# Altium schematic sheet Channel Fix (CMOS).SchDoc
size A4
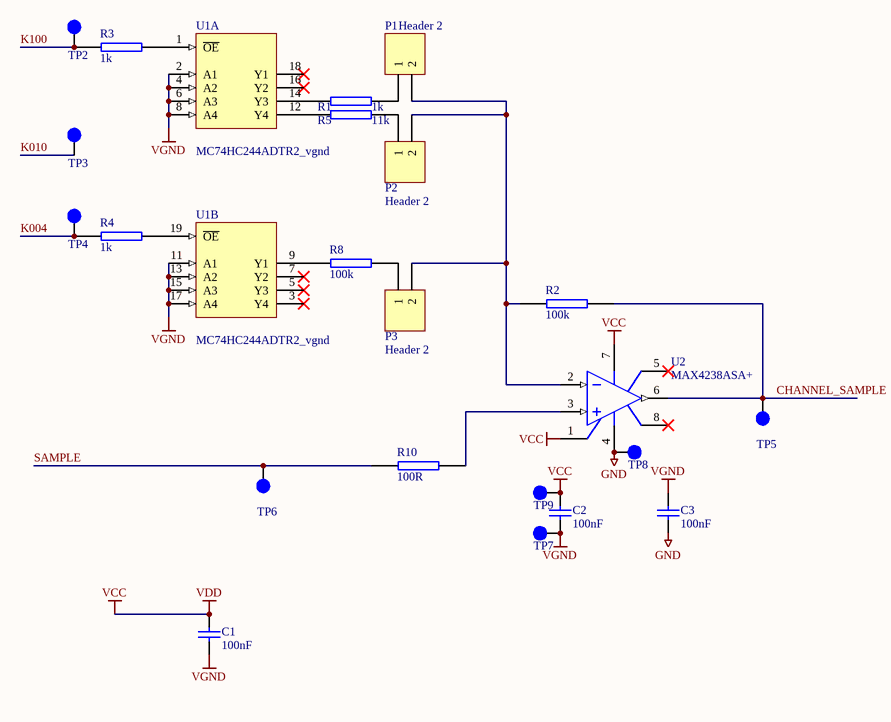
[diagram p0: Channel Fix (CMOS).SchDoc]

## Parts
C1  100nF  [CAP (3D) - 0805]
C2  100nF  [CAP (3D) - 0805]
C3  100nF  [CAP (3D) - 0805]
P1  Header 2  [HDR1X2]
P2  Header 2  [HDR1X2]
P3  Header 2  [HDR1X2]
R1  1k  [RES (3D) - 0805]
R2  100k  [RES (3D) - 0805]
R3  1k  [RES (3D) - 0805]
R4  1k  [RES (3D) - 0805]
R5  11k  [RES (3D) - 0805]
R8  100k  [RES (3D) - 0805]
R10  100R  [RES (3D) - 0805]
TP2  TestPoint  [TP]  (value not drawn)
TP3  TestPoint  [TP]  (value not drawn)
TP4  TestPoint  [TP]  (value not drawn)
TP5  TestPoint  [TP]  (value not drawn)
TP6  TestPoint  [TP]  (value not drawn)
TP7  TestPoint  [TP]  (value not drawn)
TP8  TestPoint  [TP]  (value not drawn)
TP9  TestPoint  [TP]  (value not drawn)
U1  MC74HC244ADTR2_vgnd  [DIP 20]  (parts A,B of 2)
U2  MAX4238ASA+  [SO-8]

## Nets
GND: C3.1 TP8.1 U2.4(VEE)
VCC: C1.2 C2.2 TP9.1 U1.20(VDD) U2.1(NULL) U2.7(VCC)  [also labelled VDD]
VGND: C1.1 C2.1 C3.2 TP7.1 U1.2(A1) U1.4(A2) U1.6(A3) U1.8(A4) U1.10(GND) U1.11(A1) U1.13(A2) U1.15(A3) U1.17(A4)
CHANNEL_SAMPLE: R2.2 TP5.1 U2.6(OUT)
K004: R4.1 TP4.1
K010: TP3.1
K100: R3.1 TP2.1
SAMPLE: R10.1 TP6.1
NetP1_1: P1.1 R1.2
NetP1_2: P1.2 P2.2 P3.2 R2.1 U2.2(IN-)
NetP2_1: P2.1 R5.2
NetP3_1: P3.1 R8.2
NetR1_1: R1.1 U1.14(Y3)
NetR3_2: R3.2 U1.1(~{OE})
NetR4_2: R4.2 U1.19(~{OE})
NetR5_1: R5.1 U1.12(Y4)
NetR8_1: R8.1 U1.9(Y1)
NetR10_2: R10.2 U2.3(IN+)

Not connected (* = marked no-connect by the designer): U1 3(Y4)* 5(Y3)* 7(Y2)* 16(Y2)* 18(Y1)*; U2 5(NULL)* 8(NC)*

## Library data of the parts
C1-C3 = Cap: Capacitor; Value: 100nF; Supplier 1: Mouser; Supplier 2: Digi-Key; Supplier Part Number 1: 603-C0603ZRY5V9BB104; Supplier Part Number 2: 311-1343-2-ND
P1-P3 = Header 2: Header, 2-Pin; LatestRevisionDate: 17-Jul-2002; LatestRevisionNote: Re-released for DXP Platform.; Publisher: Altium Limited
R1-R5 R8 R10 = RES SMD 0603: RESISTOR SMD 0603
  R1 R3 R4: value: 1k
  R2 R8: value: 100k
  R5: value: 11k
  R10: value: 100R
U1 = MC74HC244ADTR2: Octal 3-State Non-Inverting Buffer/Line Driver/Line Receiver; Published: 15-Apr-2002; LatestRevisionDate: 12-Dec-2006; LatestRevisionNote: IPC-7351 Footprint Added.; DatasheetVersion: Mar-2000; PackageVersion: Mar-2000; PackageReference: 948E-02; Publisher: Altium Limited; PackageDescription: 20-Pin Thin Small Outline Package 0.65 mm Pitch; ComponentLink1Description: Manufacturer Link; ComponentLink1URL: http://www.onsemi.com/; ComponentLink2Description: Datasheet; ComponentLink2URL: http://www.onsemi.com/pub/Collateral/MC74HC244A-D.PDF
U2 = MAX495CSA: Single Voltage-Feedback Operational Amplifier; Published: 23-Sep-2002; LatestRevisionDate: 13-Apr-2006; LatestRevisionNote: IPC-7351 Footprint Added.; DatasheetVersion: Rev 2; 9/96; PackageReference: NSO8; Publisher: Altium Limited; PackageDescription: 8-Pin Small Outline Integrated Circuit 1.27 mm Pitch; Code_JEDEC: MS-012-AA; Code_IPC: SOIC127P600-8; ComponentLink1Description: Manufacturer Link; ComponentLink1URL: http://www.maxim-ic.com/; ComponentLink2Description: Datasheet; ComponentLink2URL: http://pdfserv.maxim-ic.com/en/ds/MAX492-MAX495.pdf